# EAGLE design piezo-layer_v0.95-R005 (EAGLE 6.5.0)
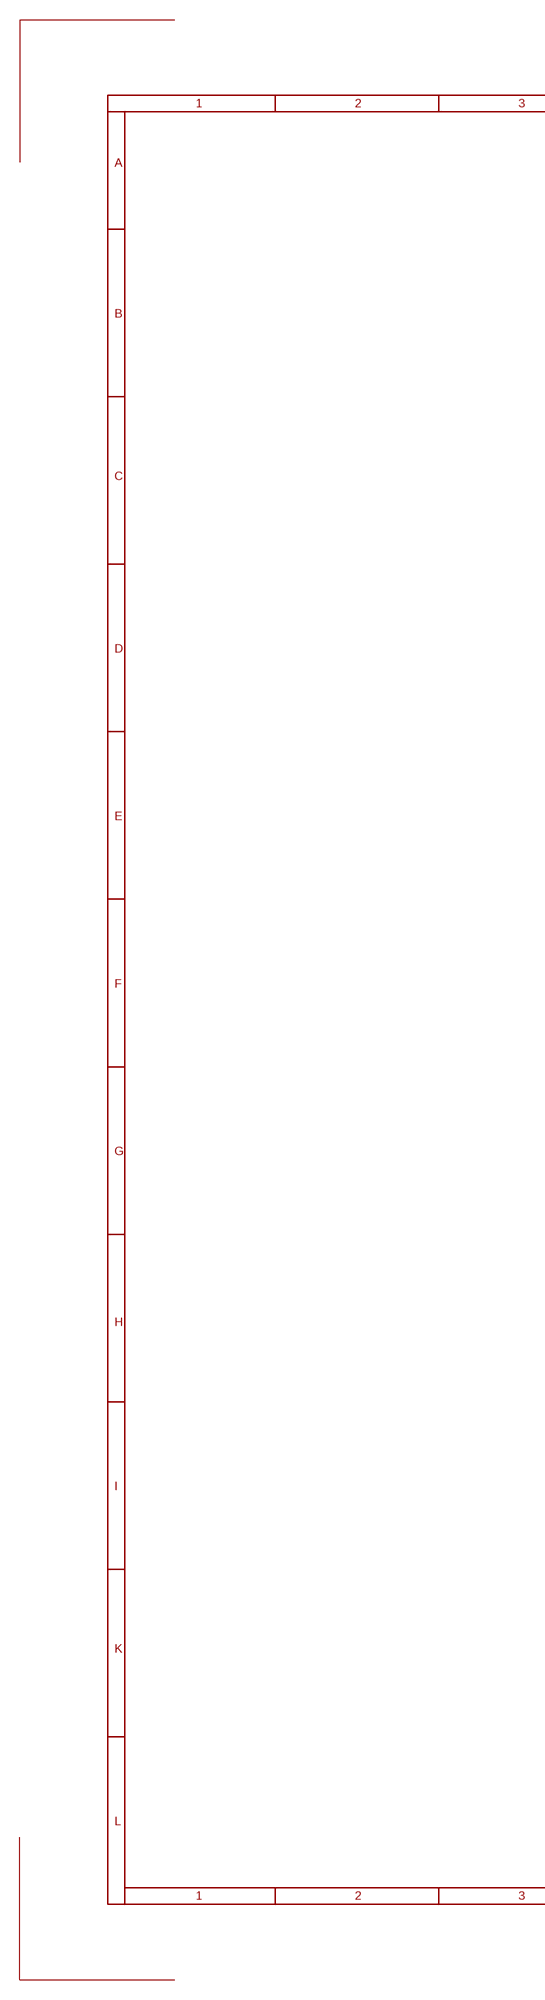
[diagram p0: schematic, sheet 1, part 1 of 2]
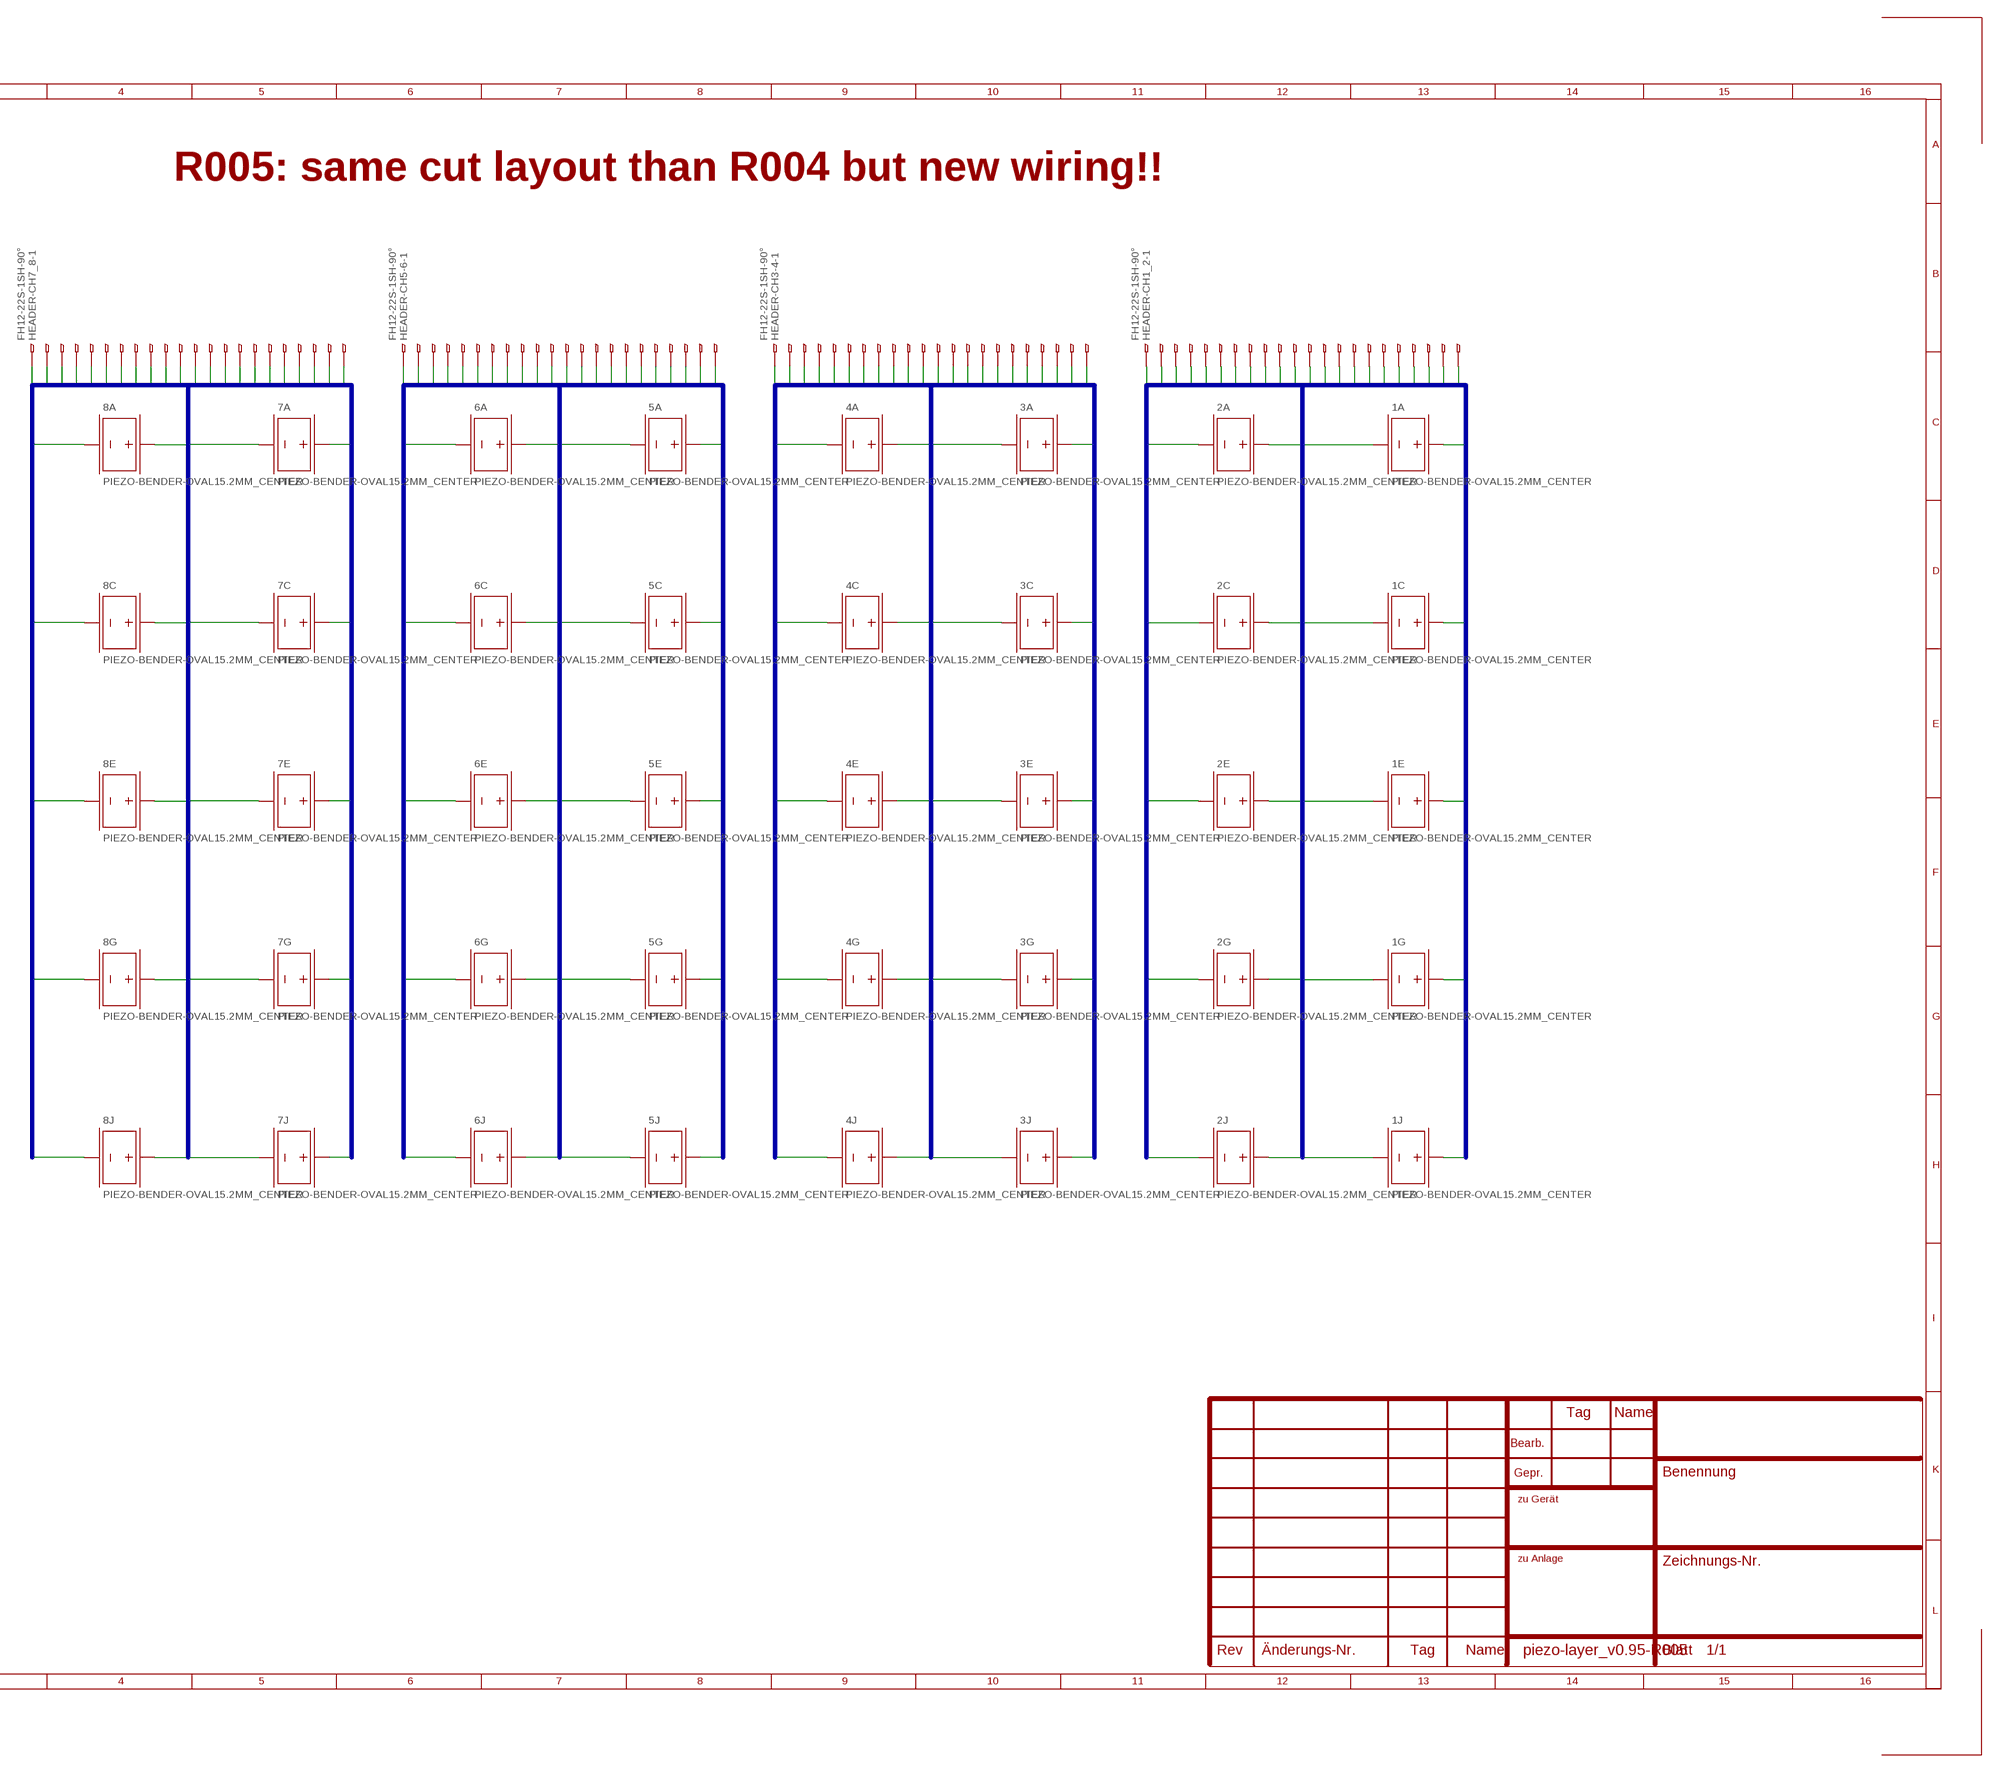
[diagram p1: schematic, sheet 1, part 2 of 2]

## Parts
1A  PIEZO-BENDER-OVAL15.2MM_CENTER  [PIEZO-BENDER-OVAL_15.2MM_BIGPADS_CENTER]
1C  PIEZO-BENDER-OVAL15.2MM_CENTER  [PIEZO-BENDER-OVAL_15.2MM_BIGPADS_CENTER]
1E  PIEZO-BENDER-OVAL15.2MM_CENTER  [PIEZO-BENDER-OVAL_15.2MM_BIGPADS_CENTER]
1G  PIEZO-BENDER-OVAL15.2MM_CENTER  [PIEZO-BENDER-OVAL_15.2MM_BIGPADS_CENTER]
1J  PIEZO-BENDER-OVAL15.2MM_CENTER  [PIEZO-BENDER-OVAL_15.2MM_BIGPADS_CENTER]
2A  PIEZO-BENDER-OVAL15.2MM_CENTER  [PIEZO-BENDER-OVAL_15.2MM_BIGPADS_CENTER]
2C  PIEZO-BENDER-OVAL15.2MM_CENTER  [PIEZO-BENDER-OVAL_15.2MM_BIGPADS_CENTER]
2E  PIEZO-BENDER-OVAL15.2MM_CENTER  [PIEZO-BENDER-OVAL_15.2MM_BIGPADS_CENTER]
2G  PIEZO-BENDER-OVAL15.2MM_CENTER  [PIEZO-BENDER-OVAL_15.2MM_BIGPADS_CENTER]
2J  PIEZO-BENDER-OVAL15.2MM_CENTER  [PIEZO-BENDER-OVAL_15.2MM_BIGPADS_CENTER]
3A  PIEZO-BENDER-OVAL15.2MM_CENTER  [PIEZO-BENDER-OVAL_15.2MM_BIGPADS_CENTER]
3C  PIEZO-BENDER-OVAL15.2MM_CENTER  [PIEZO-BENDER-OVAL_15.2MM_BIGPADS_CENTER]
3E  PIEZO-BENDER-OVAL15.2MM_CENTER  [PIEZO-BENDER-OVAL_15.2MM_BIGPADS_CENTER]
3G  PIEZO-BENDER-OVAL15.2MM_CENTER  [PIEZO-BENDER-OVAL_15.2MM_BIGPADS_CENTER]
3J  PIEZO-BENDER-OVAL15.2MM_CENTER  [PIEZO-BENDER-OVAL_15.2MM_BIGPADS_CENTER]
4A  PIEZO-BENDER-OVAL15.2MM_CENTER  [PIEZO-BENDER-OVAL_15.2MM_BIGPADS_CENTER]
4C  PIEZO-BENDER-OVAL15.2MM_CENTER  [PIEZO-BENDER-OVAL_15.2MM_BIGPADS_CENTER]
4E  PIEZO-BENDER-OVAL15.2MM_CENTER  [PIEZO-BENDER-OVAL_15.2MM_BIGPADS_CENTER]
4G  PIEZO-BENDER-OVAL15.2MM_CENTER  [PIEZO-BENDER-OVAL_15.2MM_BIGPADS_CENTER]
4J  PIEZO-BENDER-OVAL15.2MM_CENTER  [PIEZO-BENDER-OVAL_15.2MM_BIGPADS_CENTER]
5A  PIEZO-BENDER-OVAL15.2MM_CENTER  [PIEZO-BENDER-OVAL_15.2MM_BIGPADS_CENTER]
5C  PIEZO-BENDER-OVAL15.2MM_CENTER  [PIEZO-BENDER-OVAL_15.2MM_BIGPADS_CENTER]
5E  PIEZO-BENDER-OVAL15.2MM_CENTER  [PIEZO-BENDER-OVAL_15.2MM_BIGPADS_CENTER]
5G  PIEZO-BENDER-OVAL15.2MM_CENTER  [PIEZO-BENDER-OVAL_15.2MM_BIGPADS_CENTER]
5J  PIEZO-BENDER-OVAL15.2MM_CENTER  [PIEZO-BENDER-OVAL_15.2MM_BIGPADS_CENTER]
6A  PIEZO-BENDER-OVAL15.2MM_CENTER  [PIEZO-BENDER-OVAL_15.2MM_BIGPADS_CENTER]
6C  PIEZO-BENDER-OVAL15.2MM_CENTER  [PIEZO-BENDER-OVAL_15.2MM_BIGPADS_CENTER]
6E  PIEZO-BENDER-OVAL15.2MM_CENTER  [PIEZO-BENDER-OVAL_15.2MM_BIGPADS_CENTER]
6G  PIEZO-BENDER-OVAL15.2MM_CENTER  [PIEZO-BENDER-OVAL_15.2MM_BIGPADS_CENTER]
6J  PIEZO-BENDER-OVAL15.2MM_CENTER  [PIEZO-BENDER-OVAL_15.2MM_BIGPADS_CENTER]
7A  PIEZO-BENDER-OVAL15.2MM_CENTER  [PIEZO-BENDER-OVAL_15.2MM_BIGPADS_CENTER]
7C  PIEZO-BENDER-OVAL15.2MM_CENTER  [PIEZO-BENDER-OVAL_15.2MM_BIGPADS_CENTER]
7E  PIEZO-BENDER-OVAL15.2MM_CENTER  [PIEZO-BENDER-OVAL_15.2MM_BIGPADS_CENTER]
7G  PIEZO-BENDER-OVAL15.2MM_CENTER  [PIEZO-BENDER-OVAL_15.2MM_BIGPADS_CENTER]
7J  PIEZO-BENDER-OVAL15.2MM_CENTER  [PIEZO-BENDER-OVAL_15.2MM_BIGPADS_CENTER]
8A  PIEZO-BENDER-OVAL15.2MM_CENTER  [PIEZO-BENDER-OVAL_15.2MM_BIGPADS_CENTER]
8C  PIEZO-BENDER-OVAL15.2MM_CENTER  [PIEZO-BENDER-OVAL_15.2MM_BIGPADS_CENTER]
8E  PIEZO-BENDER-OVAL15.2MM_CENTER  [PIEZO-BENDER-OVAL_15.2MM_BIGPADS_CENTER]
8G  PIEZO-BENDER-OVAL15.2MM_CENTER  [PIEZO-BENDER-OVAL_15.2MM_BIGPADS_CENTER]
8J  PIEZO-BENDER-OVAL15.2MM_CENTER  [PIEZO-BENDER-OVAL_15.2MM_BIGPADS_CENTER]
HEADER-CH1_2  FH12-22S-1SH-90°  [FH12-22S-1SH]
HEADER-CH3-4  FH12-22S-1SH-90°  [FH12-22S-1SH]
HEADER-CH5-6  FH12-22S-1SH-90°  [FH12-22S-1SH]
HEADER-CH7_8  FH12-22S-1SH-90°  [FH12-22S-1SH]

## Nets
BUS1: 1J.TOP(+_1) HEADER-CH1_2.21
BUS2: HEADER-CH1_2.20
BUS3: 1G.TOP(+_1) HEADER-CH1_2.19
BUS4: HEADER-CH1_2.18
BUS5: 1A.BOTTOM(-_1) 1C.BOTTOM(-_1) 1E.BOTTOM(-_1) 1G.BOTTOM(-_1) 1J.BOTTOM(-_1) HEADER-CH1_2.16 HEADER-CH1_2.22
BUS6: 1E.TOP(+_1) HEADER-CH1_2.17
BUS7: HEADER-CH1_2.15
BUS8: 1C.TOP(+_1) HEADER-CH1_2.14
BUS9: HEADER-CH1_2.13
BUS10: 1A.TOP(+_1) HEADER-CH1_2.12
BUS11: 2J.TOP(+_1) HEADER-CH1_2.10
BUS12: HEADER-CH1_2.9
BUS13: 2G.TOP(+_1) HEADER-CH1_2.8
BUS14: HEADER-CH1_2.7
BUS15: 2A.BOTTOM(-_1) 2C.BOTTOM(-_1) 2E.BOTTOM(-_1) 2G.BOTTOM(-_1) 2J.BOTTOM(-_1) HEADER-CH1_2.5 HEADER-CH1_2.11
BUS16: 2E.TOP(+_1) HEADER-CH1_2.6
BUS17: HEADER-CH1_2.4
BUS18: 2C.TOP(+_1) HEADER-CH1_2.3
BUS19: HEADER-CH1_2.2
BUS20: 2A.TOP(+_1) HEADER-CH1_2.1
BUS21: 3J.TOP(+_1) HEADER-CH3-4.21
BUS22: HEADER-CH3-4.20
BUS23: 3G.TOP(+_1) HEADER-CH3-4.19
BUS24: HEADER-CH3-4.18
BUS25: 3A.BOTTOM(-_1) 3C.BOTTOM(-_1) 3E.BOTTOM(-_1) 3G.BOTTOM(-_1) 3J.BOTTOM(-_1) HEADER-CH3-4.16 HEADER-CH3-4.22
BUS26: 3E.TOP(+_1) HEADER-CH3-4.17
BUS27: HEADER-CH3-4.15
BUS28: 3C.TOP(+_1) HEADER-CH3-4.14
BUS29: HEADER-CH3-4.13
BUS30: 3A.TOP(+_1) HEADER-CH3-4.12
BUS31: 4J.TOP(+_1) HEADER-CH3-4.10
BUS32: HEADER-CH3-4.9
BUS33: 4G.TOP(+_1) HEADER-CH3-4.8
BUS34: HEADER-CH3-4.7
BUS35: 4A.BOTTOM(-_1) 4C.BOTTOM(-_1) 4E.BOTTOM(-_1) 4G.BOTTOM(-_1) 4J.BOTTOM(-_1) HEADER-CH3-4.5 HEADER-CH3-4.11
BUS36: 4E.TOP(+_1) HEADER-CH3-4.6
BUS37: HEADER-CH3-4.4
BUS38: 4C.TOP(+_1) HEADER-CH3-4.3
BUS39: HEADER-CH3-4.2
BUS40: 4A.TOP(+_1) HEADER-CH3-4.1
BUS41: 5J.TOP(+_1) HEADER-CH5-6.21
BUS42: HEADER-CH5-6.20
BUS43: 5G.TOP(+_1) HEADER-CH5-6.19
BUS44: HEADER-CH5-6.18
BUS45: 5A.BOTTOM(-_1) 5C.BOTTOM(-_1) 5E.BOTTOM(-_1) 5G.BOTTOM(-_1) 5J.BOTTOM(-_1) HEADER-CH5-6.16 HEADER-CH5-6.22
BUS46: 5E.TOP(+_1) HEADER-CH5-6.17
BUS47: HEADER-CH5-6.15
BUS48: 5C.TOP(+_1) HEADER-CH5-6.14
BUS49: HEADER-CH5-6.13
BUS50: 5A.TOP(+_1) HEADER-CH5-6.12
BUS51: 6J.TOP(+_1) HEADER-CH5-6.10
BUS52: HEADER-CH5-6.9
BUS53: 6G.TOP(+_1) HEADER-CH5-6.8
BUS54: HEADER-CH5-6.7
BUS55: 6A.BOTTOM(-_1) 6C.BOTTOM(-_1) 6E.BOTTOM(-_1) 6G.BOTTOM(-_1) 6J.BOTTOM(-_1) HEADER-CH5-6.5 HEADER-CH5-6.11
BUS56: 6E.TOP(+_1) HEADER-CH5-6.6
BUS57: HEADER-CH5-6.4
BUS58: 6C.TOP(+_1) HEADER-CH5-6.3
BUS59: HEADER-CH5-6.2
BUS60: 6A.TOP(+_1) HEADER-CH5-6.1
BUS61: 7J.TOP(+_1) HEADER-CH7_8.21
BUS62: HEADER-CH7_8.20
BUS63: 7G.TOP(+_1) HEADER-CH7_8.19
BUS64: HEADER-CH7_8.18
BUS65: 7A.BOTTOM(-_1) 7C.BOTTOM(-_1) 7E.BOTTOM(-_1) 7G.BOTTOM(-_1) 7J.BOTTOM(-_1) HEADER-CH7_8.16 HEADER-CH7_8.22
BUS66: 7E.TOP(+_1) HEADER-CH7_8.17
BUS67: HEADER-CH7_8.15
BUS68: 7C.TOP(+_1) HEADER-CH7_8.14
BUS69: HEADER-CH7_8.13
BUS70: 7A.TOP(+_1) HEADER-CH7_8.12
BUS71: 8J.TOP(+_1) HEADER-CH7_8.10
BUS72: HEADER-CH7_8.9
BUS73: 8G.TOP(+_1) HEADER-CH7_8.8
BUS74: HEADER-CH7_8.7
BUS75: 8A.BOTTOM(-_1) 8C.BOTTOM(-_1) 8E.BOTTOM(-_1) 8G.BOTTOM(-_1) 8J.BOTTOM(-_1) HEADER-CH7_8.5 HEADER-CH7_8.11
BUS76: 8E.TOP(+_1) HEADER-CH7_8.6
BUS77: HEADER-CH7_8.4
BUS78: 8C.TOP(+_1) HEADER-CH7_8.3
BUS79: HEADER-CH7_8.2
BUS80: 8A.TOP(+_1) HEADER-CH7_8.1

## Buses
BUS[1..20]
BUS[21..40]
BUS[41..60]
BUS[61..80]

## Notes on the sheet
- R005: same cut layout than R004 but new wiring!!

## Library data of the parts
1A 1C 1E 1G 1J 2A 2C 2E 2G 2J 3A 3C 3E 3G 3J 4A 4C 4E 4G 4J 5A 5C 5E 5G 5J 6A 6C 6E 6G 6J 7A 7C 7E 7G 7J 8A 8C 8E 8G 8J = ICST:PIEZO-BENDER-OVAL
HEADER-CH1_2 HEADER-CH3-4 HEADER-CH5-6 HEADER-CH7_8 = ICST:FH12-22S-1SH

## Board
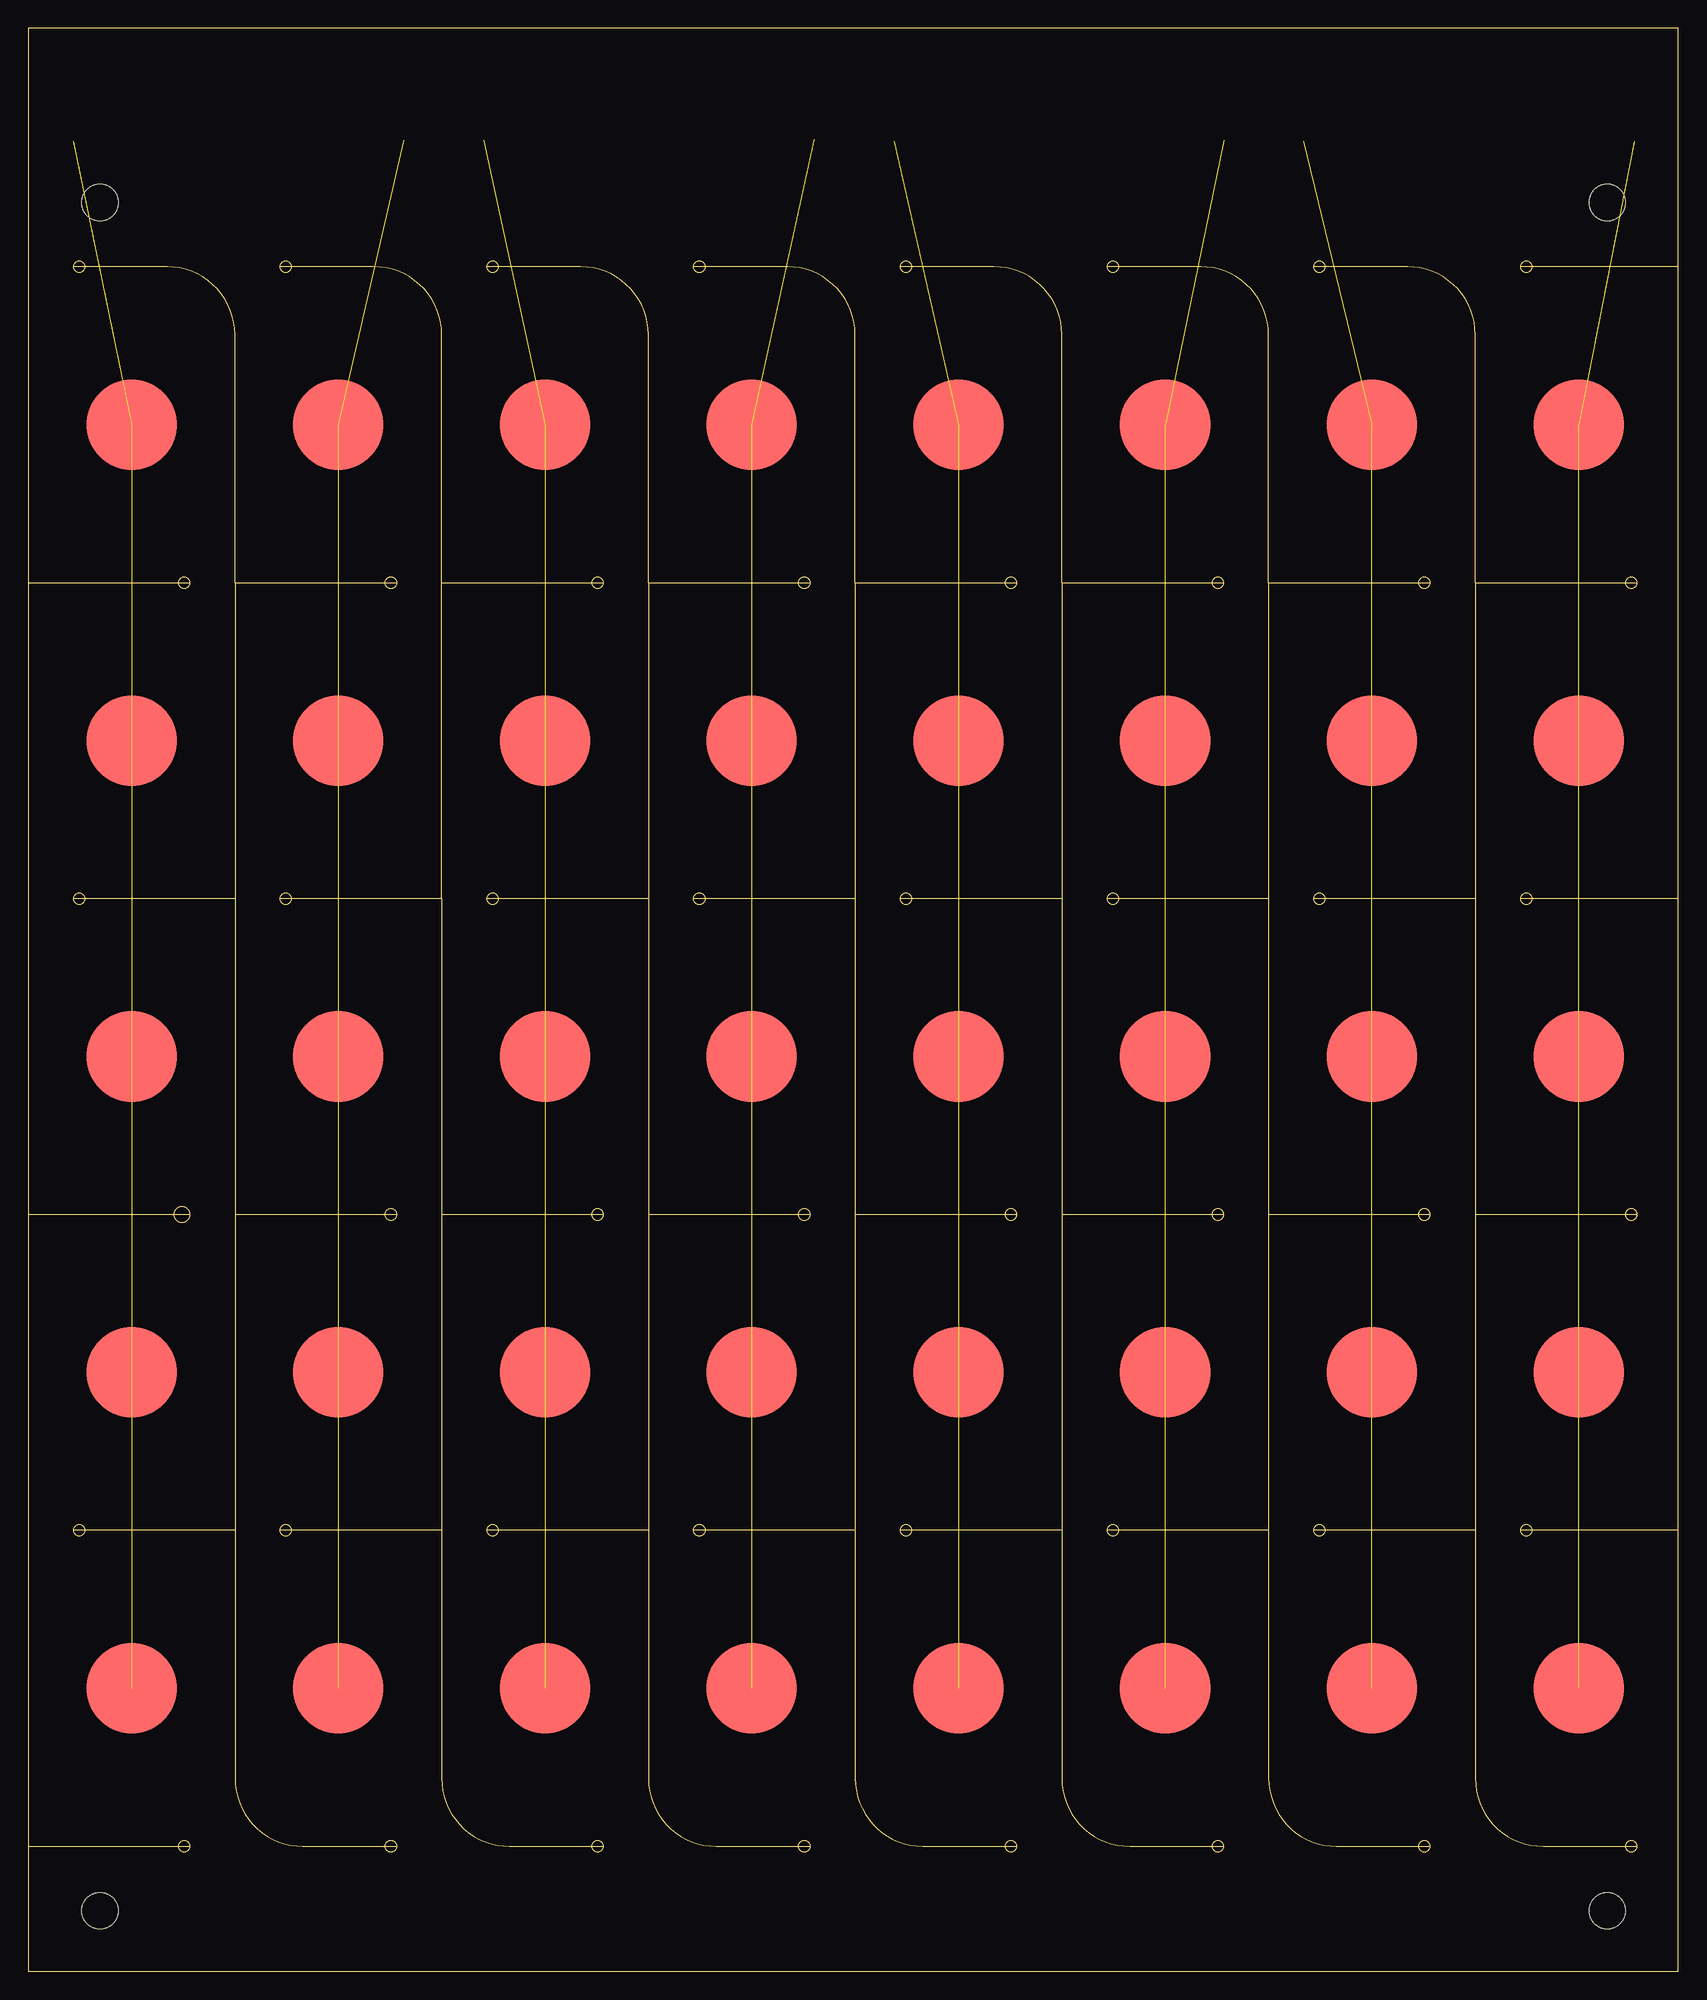
[diagram p2: board, top side]
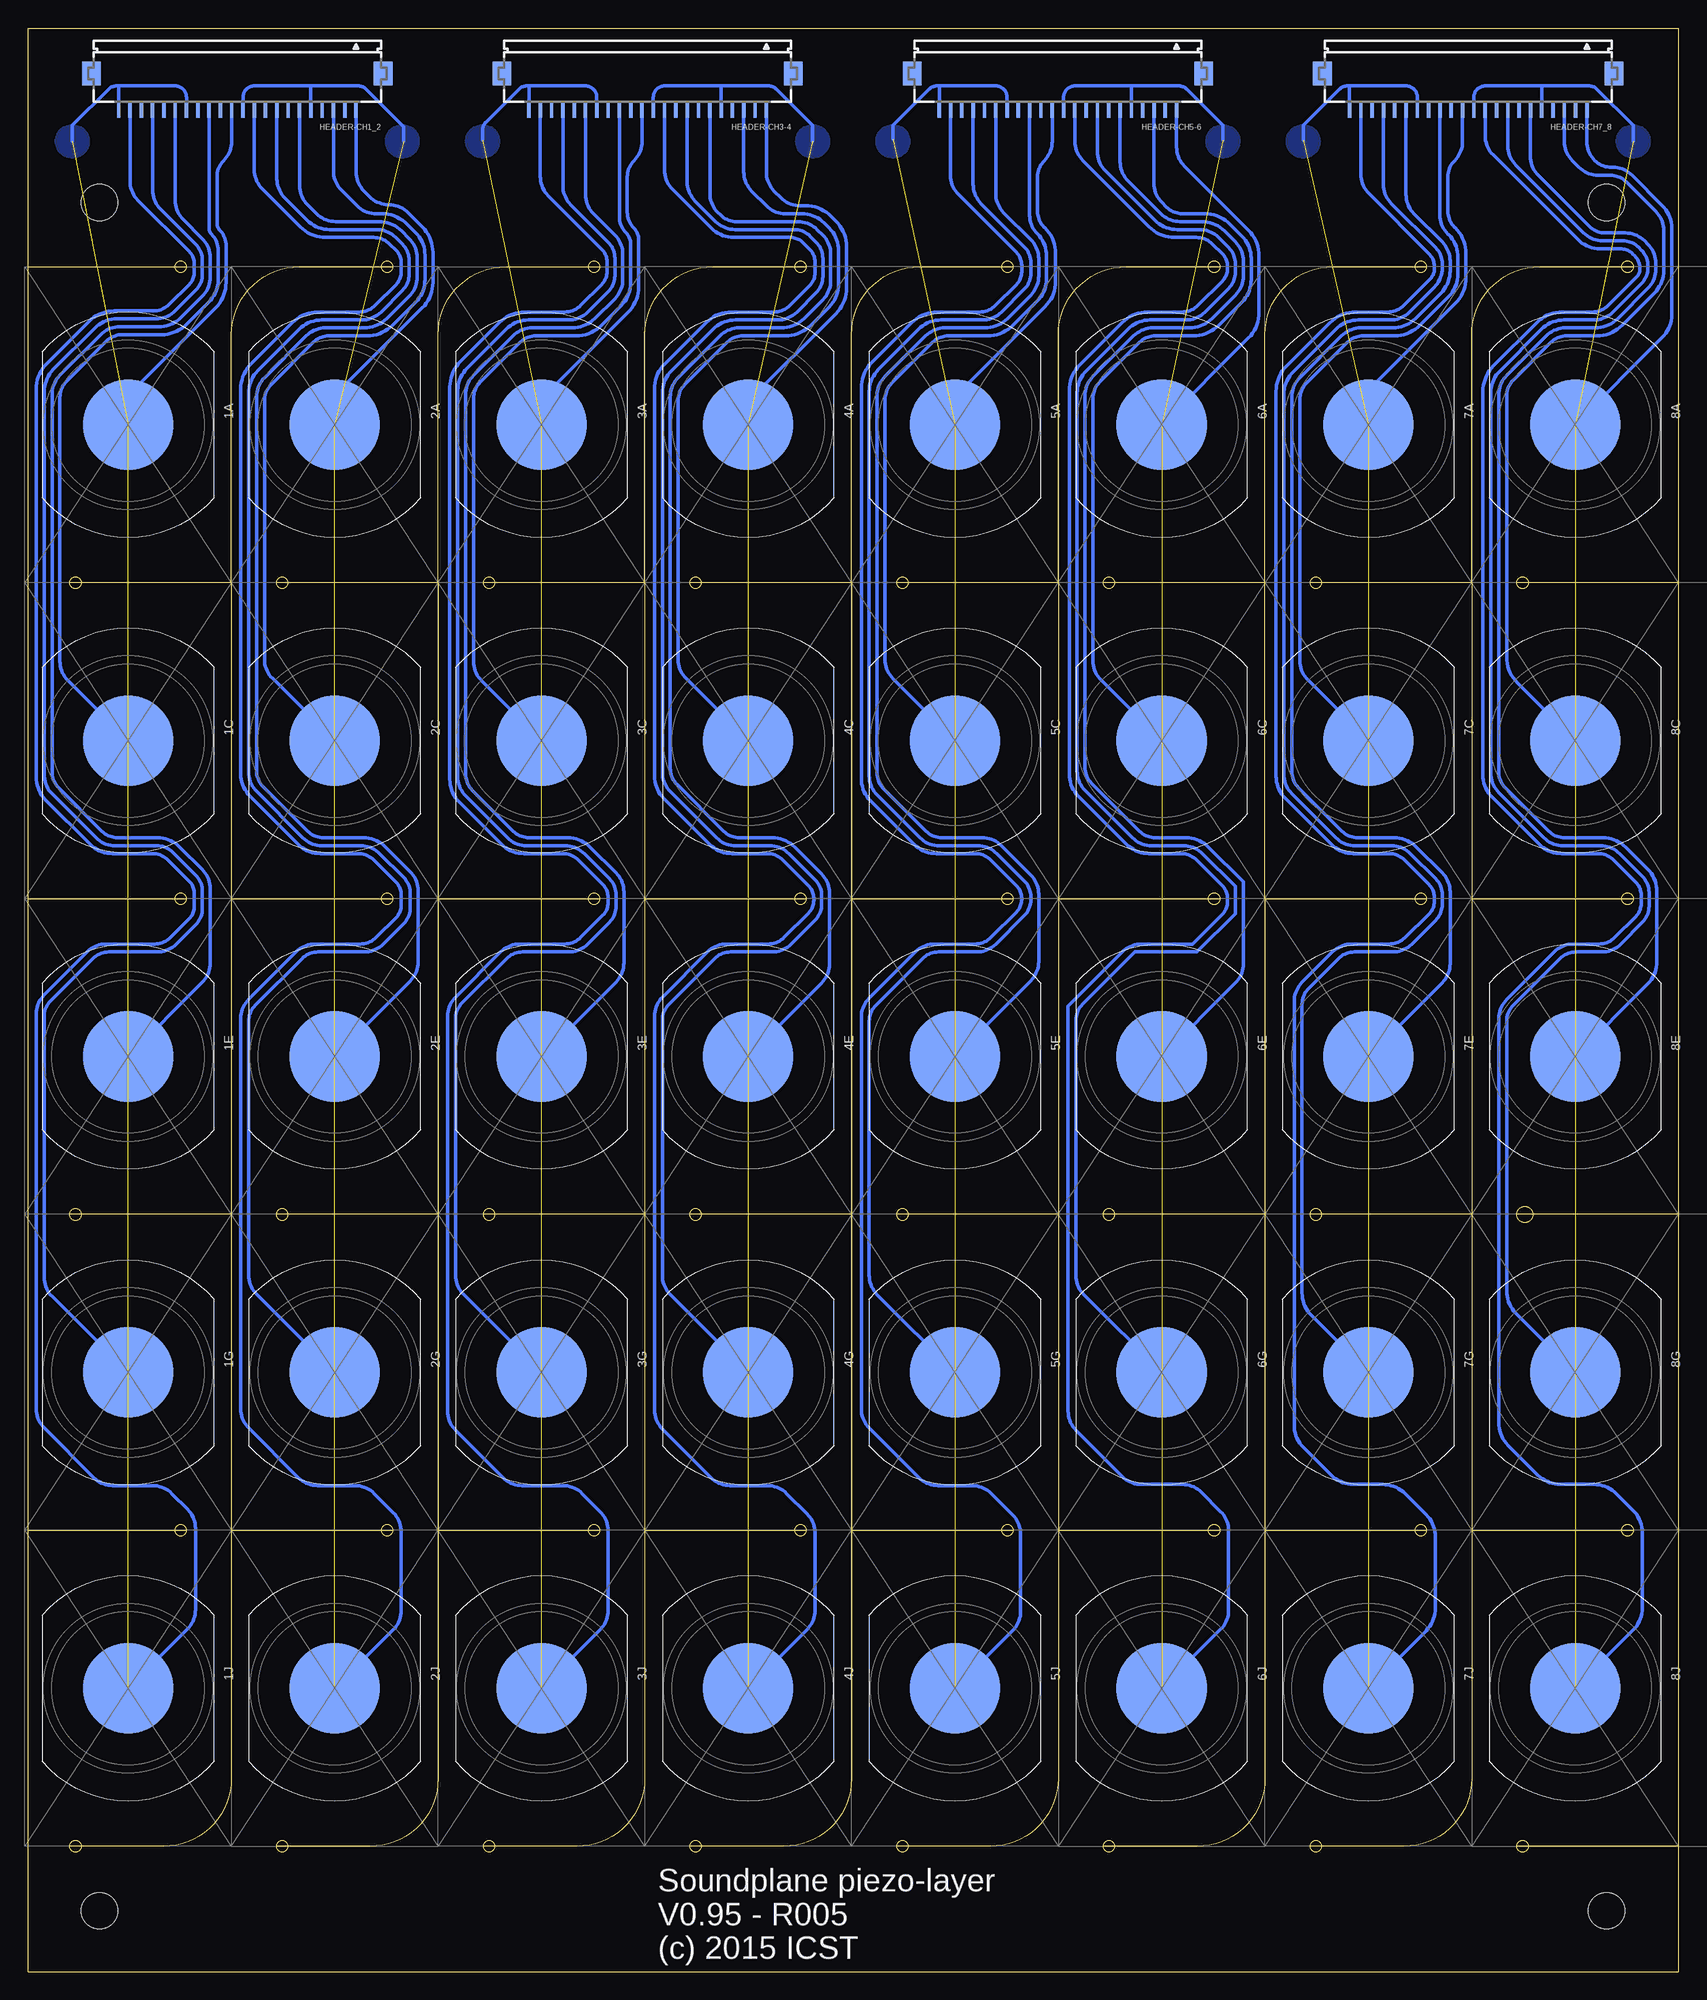
[diagram p3: board, bottom side, seen from below]

Size 146 x 171.9 mm. Coordinates in mm from the lower left corner, seen from the top.
Outline: 0,122.86 0,171.9 146,171.9 146,150.8
Outline: 0,122.86 0,66.98
Outline: 0,66.98 0,11.1
Outline: 0,11.1 0,0 146,0 146,39.04
Outline: 146,39.04 146,94.92
Outline: 146,94.92 146,150.8
Outline: 18.29,122.86 18.29,144.8 arc90 12.29,150.8 4,150.8
Outline: 18.29,39.04 18.29,17.1 arc90 24.29,11.1 32.58,11.1
Outline: 0,122.86 14.29,122.86
Outline: 0,66.98 14.29,66.98
Outline: 0,11.1 14.29,11.1
Outline: 18.29,39.04 4,39.04
Outline: 18.29,94.92 4,94.92
Outline: 36.58,94.92 36.58,122.86
Outline: 36.58,122.86 36.58,144.8 arc90 30.58,150.8 22.29,150.8
Outline: 36.58,94.92 36.58,66.98
Outline: 36.58,66.98 36.58,39.04
Outline: 36.58,39.04 36.58,17.1 arc90 42.58,11.1 50.87,11.1
Outline: 18.29,122.86 18.29,94.92
Outline: 18.29,94.92 18.29,66.98
Outline: 18.29,66.98 18.29,39.04
Outline: 18.29,122.86 32.58,122.86
Outline: 18.29,66.98 32.58,66.98
Outline: 36.58,39.04 22.29,39.04
Outline: 36.58,94.92 22.29,94.92
Outline: 54.87,122.86 54.87,144.8 arc90 48.87,150.8 40.58,150.8
Outline: 54.87,122.86 54.87,94.92
Outline: 54.87,94.92 54.87,66.98
Outline: 54.87,66.98 54.87,39.04
Outline: 54.87,39.04 54.87,17.1 arc90 60.87,11.1 69.16,11.1
Outline: 36.58,122.86 50.87,122.86
Outline: 36.58,66.98 50.87,66.98
Outline: 54.87,39.04 40.58,39.04
Outline: 54.87,94.92 40.58,94.92
Outline: 73.16,122.86 73.16,144.8 arc90 67.16,150.8 58.87,150.8
Outline: 73.16,122.86 73.16,94.92
Outline: 73.16,94.92 73.16,66.98
Outline: 73.16,66.98 73.16,39.04
Outline: 73.16,39.04 73.16,17.1 arc90 79.16,11.1 87.45,11.1
Outline: 54.87,122.86 69.16,122.86
Outline: 54.87,66.98 69.16,66.98
Outline: 73.16,39.04 58.87,39.04
Outline: 73.16,94.92 58.87,94.92
Outline: 91.45,122.86 91.45,144.8 arc90 85.45,150.8 77.16,150.8
Outline: 91.45,122.86 91.45,94.92
Outline: 91.45,94.92 91.45,66.98
Outline: 91.45,66.98 91.45,39.04
Outline: 91.45,39.04 91.45,17.1 arc90 97.45,11.1 105.74,11.1
Outline: 73.16,122.86 87.45,122.86
Outline: 73.16,66.98 87.45,66.98
Outline: 91.45,39.04 77.16,39.04
Outline: 91.45,94.92 77.16,94.92
Outline: 109.74,122.86 109.74,144.8 arc90 103.74,150.8 95.45,150.8
Outline: 109.74,122.86 109.74,94.92
Outline: 109.74,94.92 109.74,66.98
Outline: 109.74,66.98 109.74,39.04
Outline: 109.74,39.04 109.74,17.1 arc90 115.74,11.1 124.03,11.1
Outline: 91.45,122.86 105.74,122.86
Outline: 91.45,66.98 105.74,66.98
Outline: 109.74,39.04 95.45,39.04
Outline: 109.74,94.92 95.45,94.92
Outline: 128.03,122.86 128.03,144.8 arc90 122.03,150.8 113.74,150.8
Outline: 128.03,122.86 128.03,94.92
Outline: 128.03,94.92 128.03,66.98
Outline: 128.03,66.98 128.03,39.04
Outline: 128.03,39.04 128.03,17.1 arc90 134.03,11.1 142.32,11.1
Outline: 109.74,122.86 124.03,122.86
Outline: 109.74,66.98 124.03,66.98
Outline: 128.03,39.04 113.74,39.04
Outline: 128.03,94.92 113.74,94.92
Outline: 146,150.8 132.03,150.8
Outline: 128.03,122.86 142.32,122.86
Outline: 128.03,66.98 142.32,66.98
Outline: 146,39.04 132.03,39.04
Outline: 146,94.92 132.03,94.92
Outline: circle at 4.5,150.8 radius 0.5
Outline: circle at 13.79,122.86 radius 0.5
Outline: circle at 4.5,94.92 radius 0.5
Outline: circle at 13.59,66.98 radius 0.7
Outline: circle at 4.5,39.04 radius 0.5
Outline: circle at 13.79,11.1 radius 0.5
Outline: circle at 22.79,150.8 radius 0.5
Outline: circle at 32.08,122.86 radius 0.5
Outline: circle at 22.79,94.92 radius 0.5
Outline: circle at 32.08,66.98 radius 0.5
Outline: circle at 22.79,39.04 radius 0.5
Outline: circle at 32.08,11.1 radius 0.5
Outline: circle at 41.08,150.8 radius 0.5
Outline: circle at 59.37,150.8 radius 0.5
Outline: circle at 77.66,150.8 radius 0.5
Outline: circle at 95.95,150.8 radius 0.5
Outline: circle at 114.24,150.8 radius 0.5
Outline: circle at 132.53,150.8 radius 0.5
Outline: circle at 50.37,122.86 radius 0.5
Outline: circle at 68.66,122.86 radius 0.5
Copper layers 1*16: Top 0.012mm / dielectric 0.025mm / Bottom 0.012mm
Design rules "1L-0.025-0.15_0.3mm *": minimum track width 0.2mm, minimum drill 0.3mm, track to track 0.15mm, track to pad 0.15mm, pad to pad 0.15mm, via to via 0.15mm, smd to smd 0.15mm, copper to edge 0.5mm, drill to drill 1mm, minimum pad ring 10mil, minimum via ring 8mil, stop-mask expansion 4mil, vias tented up to drill 0mil, thermal gap 10mil
Holes 3.2 mm at 6.35,156.5 139.7,156.5 6.35,5.4 139.7,5.4

### Footprints (pad centres in the part's own frame; a part is rotated, then mirrored left to right if it is on the bottom)
PIEZO-BENDER-OVAL_15.2MM_BIGPADS_CENTER = smd 8 x 8 bottom: BOTTOM 0,0 | smd 8 x 8: TOP 0,0
FH12-22S-1SH = smd 0.3 x 1.3: 1 -10.5,3.25; 2 -9.5,3.25; 3 -8.5,3.25; 4 -7.5,3.25; 5 -6.5,3.25; 6 -5.5,3.25; 7 -4.5,3.25; 8 -3.5,3.25; 9 -2.5,3.25; 10 -1.5,3.25; 11 -0.5,3.25; 12 0.5,3.25; 13 1.5,3.25; 14 2.5,3.25; 15 3.5,3.25; 16 4.5,3.25; 17 5.5,3.25; 18 6.5,3.25; 19 7.5,3.25; 20 8.5,3.25; 21 9.5,3.25; 22 10.5,3.25 | smd 1.65 x 2.05: PAD1 -12.9,0; PAD2 12.9,0

### Placement (x,y rotation side)
1A  137.17,136.83 270 bottom
1C  137.17,108.89 270 bottom
1E  137.17,80.95 270 bottom
1G  137.17,53.01 270 bottom
1J  137.17,25.07 270 bottom
2A  118.88,136.83 270 bottom
2C  118.88,108.89 270 bottom
2E  118.88,80.95 270 bottom
2G  118.88,53.01 270 bottom
2J  118.88,25.07 270 bottom
3A  100.59,136.83 270 bottom
3C  100.59,108.89 270 bottom
3E  100.59,80.95 270 bottom
3G  100.59,53.01 270 bottom
3J  100.59,25.07 270 bottom
4A  82.3,136.83 270 bottom
4C  82.3,108.89 270 bottom
4E  82.3,80.95 270 bottom
4G  82.3,53.01 270 bottom
4J  82.3,25.07 270 bottom
5A  64.01,136.83 270 bottom
5C  64.01,108.89 270 bottom
5E  64.01,80.95 270 bottom
5G  64.01,53.01 270 bottom
5J  64.01,25.07 270 bottom
6A  45.72,136.83 270 bottom
6C  45.72,108.89 270 bottom
6E  45.72,80.95 270 bottom
6G  45.72,53.01 270 bottom
6J  45.72,25.07 270 bottom
7A  27.43,136.83 270 bottom
7C  27.43,108.89 270 bottom
7E  27.43,80.95 270 bottom
7G  27.43,53.01 270 bottom
7J  27.43,25.07 270 bottom
8A  9.14,136.83 270 bottom
8C  9.14,108.89 270 bottom
8E  9.14,80.95 270 bottom
8G  9.14,53.01 270 bottom
8J  9.14,25.07 270 bottom
HEADER-CH1_2  127.5,167.9 180 bottom
HEADER-CH3-4  91.2,167.9 180 bottom
HEADER-CH5-6  54.9,167.9 180 bottom
HEADER-CH7_8  18.6,167.9 180 bottom

### Tracks (layer width: path | path; a pad name or v marks a point on that pad's centre or on a via)
BUS1
  Bottom 0.3: 1J.TOP 131.9,30.34 arc-45 131.2,32.03 131.2,39.21 arc-45 131.9,40.9 133.3,42.3 arc-45 134.99,43 138.51,43 arc45 140.2,43.7 144.6,48.1 arc45 145.3,49.79 145.3,84.71 arc45 144.6,86.4 140.8,90.2 arc45 139.11,90.9 134.83,90.9 arc-45 133.41,91.49 131.77,93.13 arc-45 131.3,94.26 131.3,95.34 arc-45 131.77,96.47 133.61,98.31 arc-45 135.03,98.9 138.54,98.9 arc45 140.52,99.72 144.48,103.68 arc45 145.3,105.66 145.3,139.97 arc45 144.36,142.24 140.64,145.96 arc45 138.38,146.9 134.93,146.9 arc-45 133.51,147.49 131.77,149.23 arc-45 131.3,150.36 131.3,151.04 arc-45 131.77,152.17 136.3,156.7 arc45 137,158.39 HEADER-CH1_2.21
BUS3
  Bottom 0.3: 1G.TOP 143.9,59.74 arc45 144.6,61.43 144.6,84.47 arc45 144.01,85.89 140.29,89.61 arc45 138.87,90.2 134.59,90.2 arc-45 132.9,90.9 131.19,92.61 arc-45 130.6,94.03 130.6,95.57 arc-45 131.19,96.99 133.21,99.01 arc-45 134.63,99.6 138.31,99.6 arc45 140,100.3 143.9,104.2 arc45 144.6,105.89 144.6,139.74 arc45 143.78,141.72 140.12,145.38 arc45 138.14,146.2 134.69,146.2 arc-45 133,146.9 131.19,148.71 arc-45 130.6,150.13 130.6,151.37 arc-45 131.19,152.79 134.3,155.9 arc45 135,157.59 HEADER-CH1_2.19
BUS5  (5 unrouted)
  Bottom 0.3: HEADER-CH1_2.16 132,165.8 arc-90 133,166.8 138,166.8 | 138,166.8 138.19,166.8 arc-45 138.89,166.51 142.1,163.3 142.1,161.9 | HEADER-CH1_2.22 138,166.8
  pour Bottom: 142.1,163.4 arc90 140.6,161.9 arc90 142.1,160.4 arc90 143.6,161.9 arc90
BUS6
  Bottom 0.3: 1E.TOP 130.6,87.52 arc-45 129.9,89.21 129.9,95.81 arc-45 130.6,97.5 132.58,99.48 arc-45 134.56,100.3 138.07,100.3 arc45 139.49,100.89 143.31,104.71 arc45 143.9,106.13 143.9,139.51 arc45 143.2,141.2 139.6,144.8 arc45 137.91,145.5 134.46,145.5 arc-45 132.48,146.32 130.6,148.2 arc-45 129.9,149.89 129.9,151.61 arc-45 130.6,153.3 132.3,155 arc45 133,156.69 HEADER-CH1_2.17
BUS8
  Bottom 0.3: HEADER-CH1_2.14 130,154.2 arc-45 129.79,153.69 arc45 129.2,152.27 129.2,149.66 arc45 130.02,147.68 131.96,145.74 arc45 134.22,144.8 137.67,144.8 arc-45 139.09,144.21 142.61,140.69 arc-45 143.2,139.27 143.2,115.91 arc-45 142.5,114.22 1C.TOP
BUS10
  Bottom 0.3: 1A.TOP 137.17,139.43 129.44,147.16 arc-45 128.5,149.43 128.5,152.67 arc-45 129.09,154.09 arc45 129.3,154.6 129.3,158.76 arc45 128.7,160.2 arc-45 128,161.89 HEADER-CH1_2.12
BUS11
  Bottom 0.3: 2J.TOP 113.7,30.25 arc-45 113,31.94 113,38.91 arc-45 113.7,40.6 115.4,42.3 arc-45 117.09,43 120.41,43 arc45 122.1,43.7 126.5,48.1 arc45 127.2,49.79 127.2,84.31 arc45 126.5,86 122.3,90.2 arc45 120.61,90.9 116.63,90.9 arc-45 115.21,91.49 113.47,93.23 arc-45 113,94.36 113,95.24 arc-45 113.47,96.37 115.41,98.31 arc-45 116.83,98.9 120.14,98.9 arc45 122.12,99.72 126.38,103.98 arc45 127.2,105.96 127.2,139.97 arc45 126.26,142.24 122.64,145.86 arc45 120.38,146.8 116.73,146.8 arc-45 115.31,147.39 113.47,149.23 arc-45 113,150.36 113,151.14 arc-45 113.47,152.27 114.01,152.81 arc-45 115.43,153.4 119.67,153.4 arc45 121.94,154.34 125.3,157.7 arc45 126,159.39 HEADER-CH1_2.10
BUS13
  Bottom 0.3: 2G.TOP 125.8,59.93 arc45 126.5,61.62 126.5,84.07 arc45 125.91,85.49 121.79,89.61 arc45 120.37,90.2 116.29,90.2 arc-45 114.6,90.9 112.79,92.71 arc-45 112.2,94.13 112.2,95.37 arc-45 112.79,96.79 114.9,98.9 arc-45 116.59,99.6 120.01,99.6 arc45 121.7,100.3 125.8,104.4 arc45 126.5,106.09 126.5,139.64 arc45 125.68,141.62 122.02,145.28 arc45 120.04,146.1 116.49,146.1 arc-45 114.8,146.8 112.89,148.71 arc-45 112.3,150.13 112.3,151.37 arc-45 112.89,152.79 113.5,153.4 arc-45 115.19,154.1 119.34,154.1 arc45 121.32,154.92 123.3,156.9 arc45 124,158.59 HEADER-CH1_2.8
BUS15  (5 unrouted)
  Bottom 0.3: HEADER-CH1_2.11 127,165.8 arc90 126,166.8 121.8,166.8 121,166.8 | 121,166.8 116.81,166.8 arc45 116.11,166.51 112.8,163.2 112.8,161.9 | HEADER-CH1_2.5 121,166.8
  pour Bottom: 112.9,160.4 arc90 114.4,161.9 arc90 112.9,163.4 arc90 111.4,161.9 arc90
BUS16
  Bottom 0.3: 2E.TOP 112.2,87.63 arc-45 111.5,89.32 111.5,95.61 arc-45 112.2,97.3 114.38,99.48 arc-45 116.36,100.3 119.87,100.3 arc45 121.29,100.89 125.21,104.81 arc45 125.8,106.23 125.8,139.31 arc45 125.1,141 121.4,144.7 arc45 119.71,145.4 116.26,145.4 arc-45 114.28,146.22 112.3,148.2 arc-45 111.6,149.89 111.6,151.61 arc-45 112.3,153.3 112.98,153.98 arc-45 114.96,154.8 118.81,154.8 arc45 120.5,155.5 121.3,156.3 arc45 122,157.99 HEADER-CH1_2.6
BUS18
  Bottom 0.3: 2C.TOP 124.4,114.41 arc45 125.1,116.1 125.1,138.97 arc45 124.51,140.39 120.79,144.11 arc45 119.37,144.7 116.03,144.7 arc-45 113.76,145.64 111.72,147.68 arc-45 110.9,149.66 110.9,151.84 arc-45 111.72,153.82 112.46,154.56 arc-45 114.72,155.5 115.21,155.5 arc45 116.9,156.2 118.3,157.6 arc45 119,159.29 HEADER-CH1_2.3
BUS20
  Bottom 0.3: 2A.TOP 118.88,139.42 111.14,147.16 arc-45 110.2,149.43 110.2,152.08 arc-45 111.14,154.34 112.39,155.59 arc-45 114.11,156.3 arc45 115.8,157 116.3,157.5 arc45 117,159.19 HEADER-CH1_2.1
BUS21
  Bottom 0.3: 3J.TOP 95.4,30.26 arc-45 94.7,31.95 94.7,39.01 arc-45 95.4,40.7 97,42.3 arc-45 98.69,43 102.31,43 arc45 104,43.7 108.2,47.9 arc45 108.9,49.59 108.9,84.51 arc45 108.2,86.2 104.2,90.2 arc45 102.51,90.9 98.53,90.9 arc-45 97.11,91.49 95.17,93.43 arc-45 94.7,94.56 94.7,95.04 arc-45 95.17,96.17 97.31,98.31 arc-45 98.73,98.9 102.14,98.9 arc45 104.12,99.72 107.88,103.48 arc45 108.7,105.46 108.7,140.18 arc45 107.76,142.44 104.34,145.86 arc45 102.08,146.8 98.53,146.8 arc-45 97.11,147.39 95.27,149.23 arc-45 94.8,150.36 94.8,151.24 arc-45 95.27,152.37 100,157.1 arc45 100.7,158.79 HEADER-CH3-4.21
BUS23
  Bottom 0.3: 3G.TOP 107.5,59.92 arc45 108.2,61.61 108.2,84.27 arc45 107.61,85.69 103.69,89.61 arc45 102.27,90.2 98.19,90.2 arc-45 96.5,90.9 94.59,92.81 arc-45 94,94.23 94,95.27 arc-45 94.59,96.69 96.8,98.9 arc-45 98.49,99.6 101.91,99.6 arc45 103.6,100.3 107.3,104 arc45 108,105.69 108,139.84 arc45 107.18,141.82 103.72,145.28 arc45 101.74,146.1 98.19,146.1 arc-45 96.5,146.8 94.69,148.61 arc-45 94.1,150.03 94.1,151.57 arc-45 94.69,152.99 98,156.3 arc45 98.7,157.99 HEADER-CH3-4.19
BUS25  (5 unrouted)
  Bottom 0.3: HEADER-CH3-4.16 95.7,165.8 arc-90 96.7,166.8 101.7,166.8 | 101.7,166.8 101.89,166.8 arc-45 102.59,166.51 105.51,163.59 arc-45 105.8,162.89 105.8,162 | HEADER-CH3-4.22 101.7,166.8
  pour Bottom: 105.8,163.4 arc90 104.3,161.9 arc90 105.8,160.4 arc90 107.3,161.9 arc90
BUS26
  Bottom 0.3: 3E.TOP 94,87.54 arc-45 93.3,89.23 93.3,95.51 arc-45 94,97.2 96.28,99.48 arc-45 98.26,100.3 101.67,100.3 arc45 103.09,100.89 106.71,104.51 arc45 107.3,105.93 107.3,139.51 arc45 106.6,141.2 103.1,144.7 arc45 101.41,145.4 97.86,145.4 arc-45 95.88,146.22 94.1,148 arc-45 93.4,149.69 93.4,151.91 arc-45 94.1,153.6 96,155.5 arc45 96.7,157.19 HEADER-CH3-4.17
BUS28
  Bottom 0.3: 3C.TOP 105.9,114.2 arc45 106.6,115.89 106.6,139.17 arc45 106.01,140.59 102.49,144.11 arc45 101.07,144.7 97.53,144.7 arc-45 95.26,145.64 93.52,147.38 arc-45 92.7,149.36 92.7,152.81 arc-45 93.11,153.81 arc45 93.7,155.23 HEADER-CH3-4.14
BUS30
  Bottom 0.3: 3A.TOP 100.59,139.11 92.94,146.76 arc-45 92,149.03 92,153.21 arc-45 92.41,154.21 arc45 93,155.63 93,158.76 arc45 92.4,160.2 arc-45 91.7,161.89 HEADER-CH3-4.12
BUS31
  Bottom 0.3: 4J.TOP 77.1,30.27 arc-45 76.4,31.96 76.4,38.81 arc-45 77.1,40.5 78.9,42.3 arc-45 80.59,43 83.91,43 arc45 85.6,43.7 89.9,48 arc45 90.6,49.69 90.6,84.51 arc45 89.9,86.2 85.9,90.2 arc45 84.21,90.9 80.53,90.9 arc-45 79.11,91.49 76.97,93.63 arc-45 76.5,94.76 76.5,94.94 arc-45 76.97,96.07 79.21,98.31 arc-45 80.63,98.9 83.74,98.9 arc45 85.72,99.72 89.78,103.78 arc45 90.6,105.76 90.6,139.97 arc45 89.66,142.24 86.04,145.86 arc45 83.78,146.8 80.03,146.8 arc-45 78.61,147.39 76.87,149.13 arc-45 76.4,150.26 76.4,151.24 arc-45 76.87,152.37 77.43,152.93 arc-45 78.56,153.4 83.58,153.4 arc45 85.56,154.22 89,157.66 arc45 89.7,159.35 HEADER-CH3-4.10
BUS33
  Bottom 0.3: HEADER-CH3-4.8 87.7,158.32 arc-45 87,156.62 85.18,154.8 arc-45 83.48,154.1 78.23,154.1 arc45 76.81,153.51 76.29,152.99 arc45 75.7,151.57 75.7,149.93 arc45 76.29,148.51 78,146.8 arc45 79.69,146.1 83.44,146.1 arc-45 85.42,145.28 89.08,141.62 arc-45 89.9,139.64 89.9,106.09 arc-45 89.2,104.4 85.1,100.3 arc-45 83.41,99.6 80.39,99.6 arc45 78.7,98.9 76.39,96.59 arc45 75.8,95.17 75.8,94.43 arc45 76.39,93.01 78.5,90.9 arc45 80.19,90.2 83.87,90.2 arc-45 85.29,89.61 89.31,85.59 arc-45 89.9,84.17 89.9,61.6 arc-45 89.2,59.91 4G.TOP
BUS35  (5 unrouted)
  Bottom 0.3: HEADER-CH3-4.11 90.7,165.8 arc90 89.7,166.8 84.7,166.8 | 84.7,166.8 80.51,166.8 arc45 79.81,166.51 76.6,163.3 76.6,161.9 | HEADER-CH3-4.5 84.7,166.8
  pour Bottom: 76.6,160.4 arc90 78.1,161.9 arc90 76.6,163.4 arc90 75.1,161.9 arc90
BUS36
  Bottom 0.3: HEADER-CH3-4.6 85.7,157.32 arc-45 85,155.62 84.76,155.39 arc-45 83.34,154.8 77.89,154.8 arc45 76.2,154.1 75.7,153.6 arc45 75,151.91 75,149.59 arc45 75.7,147.9 77.38,146.22 arc45 79.36,145.4 83.11,145.4 arc-45 84.8,144.7 88.5,141 arc-45 89.2,139.31 89.2,106.43 arc-45 88.61,105.01 84.49,100.89 arc-45 83.07,100.3 80.16,100.3 arc45 78.18,99.48 75.8,97.1 arc45 75.1,95.41 75.1,89.14 arc45 75.8,87.45 4E.TOP
BUS38
  Bottom 0.3: 4C.TOP 87.8,114.39 arc45 88.5,116.08 88.5,138.97 arc45 87.91,140.39 84.19,144.11 arc45 82.77,144.7 79.03,144.7 arc-45 76.76,145.64 75.12,147.28 arc-45 74.3,149.26 74.3,152.24 arc-45 75.12,154.22 75.58,154.68 arc-45 77.56,155.5 79.01,155.5 arc45 80.7,156.2 82,157.5 arc45 82.7,159.19 HEADER-CH3-4.3
BUS40
  Bottom 0.3: 4A.TOP 82.3,138.9 74.54,146.66 arc-45 73.6,148.93 73.6,152.58 arc-45 74.54,154.84 74.96,155.26 arc-45 77.22,156.2 77.71,156.2 arc45 79.4,156.9 80,157.5 arc45 80.7,159.19 HEADER-CH3-4.1
BUS41
  Bottom 0.3: 5J.TOP 58.9,30.18 arc-45 58.2,31.87 58.2,38.71 arc-45 58.9,40.4 60.8,42.3 arc-45 62.49,43 65.51,43 arc45 67.2,43.7 71.6,48.1 arc45 72.3,49.79 72.3,84.41 arc45 71.6,86.1 67.5,90.2 arc45 65.81,90.9 62.23,90.9 arc-45 60.81,91.49 58.57,93.73 arc-45 58.1,94.86 58.1,94.94 arc-45 58.57,96.07 60.81,98.31 arc-45 62.23,98.9 65.64,98.9 arc45 67.62,99.72 71.48,103.58 arc45 72.3,105.56 72.3,140.08 arc45 71.36,142.34 67.84,145.86 arc45 65.58,146.8 61.83,146.8 arc-45 60.41,147.39 58.57,149.23 arc-45 58.1,150.36 58.1,150.94 arc-45 58.57,152.07 63.7,157.2 arc45 64.4,158.89 HEADER-CH5-6.21
BUS43
  Bottom 0.3: 5G.TOP 70.9,59.9 arc45 71.6,61.59 71.6,84.07 arc45 71.01,85.49 66.89,89.61 arc45 65.47,90.2 62.09,90.2 arc-45 60.4,90.9 57.89,93.41 arc-45 57.3,94.83 57.3,95.07 arc-45 57.89,96.49 60.3,98.9 arc-45 61.99,99.6 65.41,99.6 arc45 67.1,100.3 70.9,104.1 arc45 71.6,105.79 71.6,139.74 arc45 70.78,141.72 67.22,145.28 arc45 65.24,146.1 61.59,146.1 arc-45 59.9,146.8 57.89,148.81 arc-45 57.3,150.23 57.3,151.17 arc-45 57.89,152.59 61.7,156.4 arc45 62.4,158.09 HEADER-CH5-6.19
BUS45  (5 unrouted)
  Bottom 0.3: HEADER-CH5-6.16 59.4,165.8 arc-90 60.4,166.8 65.4,166.8 | 65.4,166.8 65.59,166.8 arc-45 66.29,166.51 69.5,163.3 69.5,162.1 | HEADER-CH5-6.22 65.4,166.8
  pour Bottom: 69.5,163.4 arc90 68,161.9 arc90 69.5,160.4 arc90 71,161.9 arc90
BUS46
  Bottom 0.3: 5E.TOP 57.3,87.66 arc-45 56.6,89.35 56.6,95.31 arc-45 57.3,97 59.9,99.6 arc-45 61.59,100.3 65.17,100.3 arc45 66.59,100.89 70.31,104.61 arc45 70.9,106.03 70.9,139.41 arc45 70.2,141.1 66.6,144.7 arc45 64.91,145.4 61.36,145.4 arc-45 59.38,146.22 57.3,148.3 arc-45 56.6,149.99 56.6,151.51 arc-45 57.3,153.2 59.7,155.6 arc45 60.4,157.29 HEADER-CH5-6.17
BUS48
  Bottom 0.3: 5C.TOP 69.5,114.38 arc45 70.2,116.07 70.2,139.07 arc45 69.61,140.49 65.99,144.11 arc45 64.57,144.7 61.12,144.7 arc-45 58.86,145.64 56.72,147.78 arc-45 55.9,149.76 55.9,151.74 arc-45 56.72,153.72 arc45 57.4,155.36 HEADER-CH5-6.14
BUS50
  Bottom 0.3: 5A.TOP arc-45 63.7,137.58 63.7,139.6 56.04,147.26 arc-45 55.1,149.53 55.1,151.97 arc-45 56.04,154.24 56.11,154.31 arc45 56.7,155.73 56.7,158.76 arc45 56.1,160.2 arc-45 55.4,161.89 HEADER-CH5-6.12
BUS51
  Bottom 0.3: 6J.TOP 40.5,30.29 arc-45 39.8,31.98 39.8,39.01 arc-45 40.5,40.7 42.2,42.4 arc-45 43.89,43.1 47.51,43.1 arc45 49.2,43.8 53.3,47.9 arc45 54,49.59 54,85.4 49.2,90.2 arc45 47.51,90.9 43,90.9 40.37,93.53 arc-45 39.9,94.66 39.9,94.94 arc-45 40.37,96.07 42.61,98.31 arc-45 44.03,98.9 46.84,98.9 arc45 48.82,99.72 53.08,103.98 arc45 53.9,105.96 53.9,139.88 arc45 52.96,142.14 49.24,145.86 arc45 46.98,146.8 43.93,146.8 arc-45 42.51,147.39 40.37,149.53 arc-45 39.9,150.66 39.9,150.84 arc-45 40.37,151.97 41.21,152.81 arc-45 42.63,153.4 44.58,153.4 arc45 46.84,154.34 52.7,160.2 arc45 53.4,161.89 HEADER-CH5-6.10
BUS53
  Bottom 0.3: 6G.TOP 52.6,59.89 arc45 53.3,61.58 53.3,84.17 arc45 52.71,85.59 48.1,90.2 42.6,90.2 39.2,93.6 39.2,96 42.1,98.9 arc-45 43.79,99.6 46.61,99.6 arc45 48.3,100.3 52.5,104.5 arc45 53.2,106.19 53.2,139.64 arc45 52.38,141.62 48.72,145.28 arc45 46.74,146.1 43.59,146.1 arc-45 41.9,146.8 39.79,148.91 arc-45 39.2,150.33 39.2,151.07 arc-45 39.79,152.49 40.7,153.4 arc-45 42.39,154.1 44.34,154.1 arc45 46.32,154.92 50.7,159.3 arc45 51.4,160.99 HEADER-CH5-6.8
BUS55  (5 unrouted)
  Bottom 0.3: HEADER-CH5-6.11 54.4,165.8 arc90 53.4,166.8 48.9,166.8 48.4,166.8 | 48.4,166.8 44.21,166.8 arc45 43.51,166.51 40.3,163.3 40.3,162 | HEADER-CH5-6.5 48.4,166.8
  pour Bottom: 40.3,160.4 arc90 41.8,161.9 arc90 40.3,163.4 arc90 38.8,161.9 arc90
BUS56
  Bottom 0.3: 6E.TOP 39.2,87.47 arc-45 38.5,89.16 38.5,96.4 41.58,99.48 arc-45 43.56,100.3 46.27,100.3 arc45 47.69,100.89 51.91,105.11 arc45 52.5,106.53 52.5,139.41 arc45 51.8,141.1 48.2,144.7 arc45 46.51,145.4 43.26,145.4 arc-45 41.28,146.22 39.2,148.3 arc-45 38.5,149.99 38.5,151.31 arc-45 39.2,153 40.18,153.98 arc-45 42.16,154.8 44.11,154.8 arc45 45.8,155.5 48.7,158.4 arc45 49.4,160.09 HEADER-CH5-6.6
BUS58
  Bottom 0.3: 6C.TOP 51.1,114.27 arc45 51.8,115.96 51.8,139.17 arc45 51.21,140.59 47.69,144.11 arc45 46.27,144.7 42.92,144.7 arc-45 40.66,145.64 38.62,147.68 arc-45 37.8,149.66 37.8,151.54 arc-45 38.62,153.52 39.66,154.56 arc-45 41.92,155.5 43.87,155.5 arc45 45.29,156.09 45.7,156.5 arc45 46.4,158.19 HEADER-CH5-6.3
BUS60
  Bottom 0.3: 6A.TOP 38.04,144.51 arc-45 37.1,146.78 37.1,151.78 arc-45 38.04,154.04 43.7,159.7 arc45 44.4,161.39 HEADER-CH5-6.1
BUS61
  Bottom 0.3: 7J.TOP 22.32,30.18 arc-45 21.5,32.16 21.5,38.44 arc-45 22.32,40.42 24.18,42.28 arc-45 26.16,43.1 28.74,43.1 arc45 30.72,43.92 33.18,46.38 arc45 34,48.36 34,85.81 arc45 33.3,87.5 30.6,90.2 arc45 28.91,90.9 25.61,90.9 arc-44 24.22,91.46 22.09,93.53 arc-46 21.6,94.68 21.6,95.04 arc-45 22.07,96.17 24.21,98.31 arc-45 25.63,98.9 28.74,98.9 arc45 30.72,99.72 34.78,103.78 arc45 35.6,105.76 35.6,139.78 arc45 34.66,142.04 30.84,145.86 arc45 28.57,146.8 25.73,146.8 arc-45 24.31,147.39 21.93,149.77 arc-45 21.6,150.57 21.6,150.84 arc-45 22.07,151.97 27.4,157.3 arc45 28.1,158.99 HEADER-CH7_8.21
BUS63
  Bottom 0.3: 7G.TOP 32.48,58.06 arc45 33.3,60.04 33.3,85.57 arc45 32.71,86.99 30.09,89.61 arc45 28.67,90.2 25.29,90.2 arc-45 23.6,90.9 21.49,93.01 arc-45 20.9,94.43 20.9,95.27 arc-45 21.49,96.69 23.7,98.9 arc-45 25.39,99.6 28.61,99.6 arc45 30.3,100.3 34.2,104.2 arc45 34.9,105.89 34.9,139.54 arc45 34.08,141.52 30.32,145.28 arc45 28.34,146.1 25.49,146.1 arc-45 23.8,146.8 21.6,149 arc-45 20.9,150.69 20.9,151.07 arc-45 21.49,152.49 25.4,156.4 arc45 26.1,158.09 HEADER-CH7_8.19
BUS65  (5 unrouted)
  Bottom 0.3: HEADER-CH7_8.16 23.1,165.8 arc-90 24.1,166.8 28.7,166.8 29.1,166.8 | 29.1,166.8 29.29,166.8 arc-45 29.99,166.51 33.2,163.3 33.2,162 | HEADER-CH7_8.22 29.1,166.8
  pour Bottom: 33.2,163.4 arc90 31.7,161.9 arc90 33.2,160.4 arc90 34.7,161.9 arc90
BUS66
  Bottom 0.3: 7E.TOP 20.9,87.48 arc-45 20.2,89.17 20.2,95.51 arc-45 20.9,97.2 23.18,99.48 arc-45 25.16,100.3 28.37,100.3 arc45 29.79,100.89 33.61,104.71 arc45 34.2,106.13 34.2,139.31 arc45 33.5,141 29.8,144.7 arc45 28.11,145.4 25.26,145.4 arc-45 23.28,146.22 21.02,148.48 arc-45 20.2,150.46 20.2,151.31 arc-45 20.9,153 23.4,155.5 arc45 24.1,157.19 HEADER-CH7_8.17
BUS68
  Bottom 0.3: 7C.TOP 32.8,114.26 arc45 33.5,115.95 33.5,139.07 arc45 32.91,140.49 29.29,144.11 arc45 27.87,144.7 25.12,144.7 arc-45 22.86,145.64 20.32,148.18 arc-45 19.5,150.16 19.5,151.64 arc-45 20.32,153.62 20.4,153.7 arc45 21.1,155.39 HEADER-CH7_8.14
BUS70
  Bottom 0.3: 7A.TOP 27.43,139.87 19.74,147.56 arc-45 18.8,149.83 18.8,151.97 arc-45 19.74,154.24 19.81,154.31 arc45 20.4,155.73 20.4,158.76 arc45 19.8,160.2 arc-45 19.1,161.89 HEADER-CH7_8.12
BUS71
  Bottom 0.3: 8J.TOP 4.02,30.19 arc-45 3.2,32.17 3.2,38.84 arc-45 4.02,40.82 5.48,42.28 arc-45 7.46,43.1 10.44,43.1 arc45 12.42,43.92 15.08,46.58 arc45 15.9,48.56 15.9,84.31 arc45 15.2,86 11,90.2 arc45 9.31,90.9 7.03,90.9 arc-45 5.61,91.49 3.77,93.33 arc-45 3.3,94.46 3.3,95.24 arc-45 3.77,96.37 5.71,98.31 arc-45 7.13,98.9 10.34,98.9 arc45 12.32,99.72 16.48,103.88 arc45 17.3,105.86 17.3,139.78 arc45 16.36,142.04 12.54,145.86 arc45 10.28,146.8 7.63,146.8 arc-45 6.21,147.39 3.71,149.89 arc-45 3.4,150.64 arc-45 3.87,151.77 4.03,151.93 arc-45 5.16,152.4 6.94,152.4 arc45 8.92,153.22 16.4,160.7 arc45 17.1,162.39 HEADER-CH7_8.10
BUS73
  Bottom 0.3: 8G.TOP 14.38,58.25 arc45 15.2,60.23 15.2,84.07 arc45 14.61,85.49 10.49,89.61 arc45 9.07,90.2 6.79,90.2 arc-45 5.1,90.9 3.19,92.81 arc-45 2.6,94.23 2.6,95.47 arc-45 3.19,96.89 5.2,98.9 arc-45 6.89,99.6 10.21,99.6 arc45 11.9,100.3 15.9,104.3 arc45 16.6,105.99 16.6,139.64 arc45 15.78,141.62 12.12,145.28 arc45 10.14,146.1 7.49,146.1 arc-45 5.8,146.8 3.29,149.31 arc-45 2.7,150.73 2.7,150.87 arc-45 3.29,152.29 3.51,152.51 arc-45 4.93,153.1 6.71,153.1 arc45 8.4,153.8 14.4,159.8 arc45 15.1,161.49 HEADER-CH7_8.8
BUS75  (5 unrouted)
  Bottom 0.3: HEADER-CH7_8.11 18.1,165.8 arc90 17.1,166.8 12.7,166.8 12.1,166.8 | 12.1,166.8 7.91,166.8 arc45 7.21,166.51 4,163.3 4,161.9 | HEADER-CH7_8.5 12.1,166.8
  pour Bottom: 4,160.4 arc90 5.5,161.9 arc90 4,163.4 arc90 2.5,161.9 arc90
BUS76
  Bottom 0.3: 8E.TOP 2.72,87.37 arc-45 1.9,89.35 1.9,95.54 arc-45 2.72,97.52 4.68,99.48 arc-45 6.66,100.3 10.07,100.3 arc45 11.49,100.89 15.31,104.71 arc45 15.9,106.13 15.9,139.51 arc45 15.2,141.2 11.7,144.7 arc45 10.01,145.4 7.36,145.4 arc-45 5.38,146.22 2.7,148.9 arc-45 2,150.59 2,151.11 arc-45 2.7,152.8 3,153.1 arc-45 4.69,153.8 6.47,153.8 arc45 7.89,154.39 12.4,158.9 arc45 13.1,160.59 HEADER-CH7_8.6
BUS78
  Bottom 0.3: 8C.TOP 14.26,114.01 arc45 15.2,116.28 15.2,139.37 arc45 14.61,140.79 11.29,144.11 arc45 9.87,144.7 7.22,144.7 arc-45 4.96,145.64 2.12,148.48 arc-45 1.3,150.46 1.3,154.01 arc-45 2,155.7 4.61,158.31 arc-45 6.03,158.9 7.11,158.9 arc45 8.8,159.6 9.4,160.2 arc45 10.1,161.89 HEADER-CH7_8.3
BUS80
  Bottom 0.3: 8A.TOP 1.42,144.55 arc-45 0.6,146.53 0.6,154.24 arc-45 1.42,156.22 4.1,158.9 arc-45 5.79,159.6 5.96,159.6 arc45 7.4,160.2 arc45 8.1,161.89 HEADER-CH7_8.1

### Text on the board
bPlace: Soundplane piezo-layer / V0.95 - R005 / (c) 2015 ICST